# Altium project mini_DVM.PrjPcb
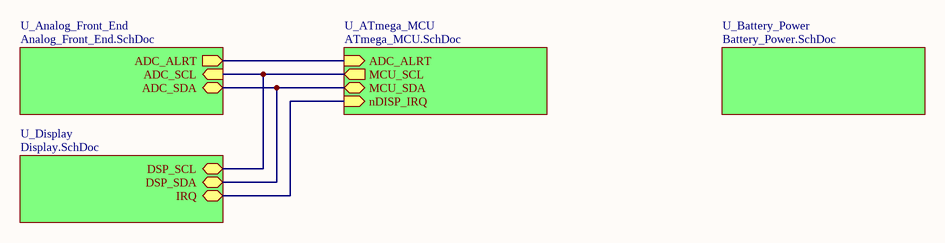
[diagram p0: DVM_TopLevel.SchDoc]
5 sheets, 62 parts. Net scope: hierarchical (ports join the sheet entries above them; power ports are global).
Board file: mini-dvm.PcbDoc
Sheets:
  DVM_TopLevel.SchDoc
    U_Analog_Front_End = Analog_Front_End.SchDoc
    U_ATmega_MCU = ATmega_MCU.SchDoc
    U_Display = Display.SchDoc
    U_Battery_Power = Battery_Power.SchDoc

## Sheet DVM_TopLevel.SchDoc
size B; Organization: Mechanart, LLC; Address1: 397 Laurie Meadows Drive; Address2: Apt. 437; Address3: San Mateo, CA 94403

### Sub-sheets
U_Analog_Front_End = Analog_Front_End.SchDoc: ADC_ALRT (out), ADC_SCL (in), ADC_SDA (bidir)
U_ATmega_MCU = ATmega_MCU.SchDoc: ADC_ALRT (in), MCU_SDA (bidir), MCU_SCL (out), nDISP_IRQ (in)
U_Battery_Power = Battery_Power.SchDoc: no entries
U_Display = Display.SchDoc: DSP_SCL, DSP_SDA, IRQ

### Nets
MCU_SCL: sheet U_Analog_Front_End/ADC_SCL, sheet U_ATmega_MCU/MCU_SCL, sheet U_Display/DSP_SCL
MCU_SDA: sheet U_Analog_Front_End/ADC_SDA, sheet U_ATmega_MCU/MCU_SDA, sheet U_Display/DSP_SDA
NetR23_1: sheet U_Analog_Front_End/ADC_ALRT, sheet U_ATmega_MCU/ADC_ALRT
NetU2_32: sheet U_ATmega_MCU/nDISP_IRQ, sheet U_Display/IRQ

### Notes on the sheet
- Title
- Size:
- Date:
- B
- Number:
- Time:
- Revision:
- Sheet
- of
- File:

## Sheet Analog_Front_End.SchDoc
size B; Organization: Mechanart, LLC; Address1: 397 Laurie Meadows Drive; Address2: Apt. 437; Address3: San Mateo, CA 94403
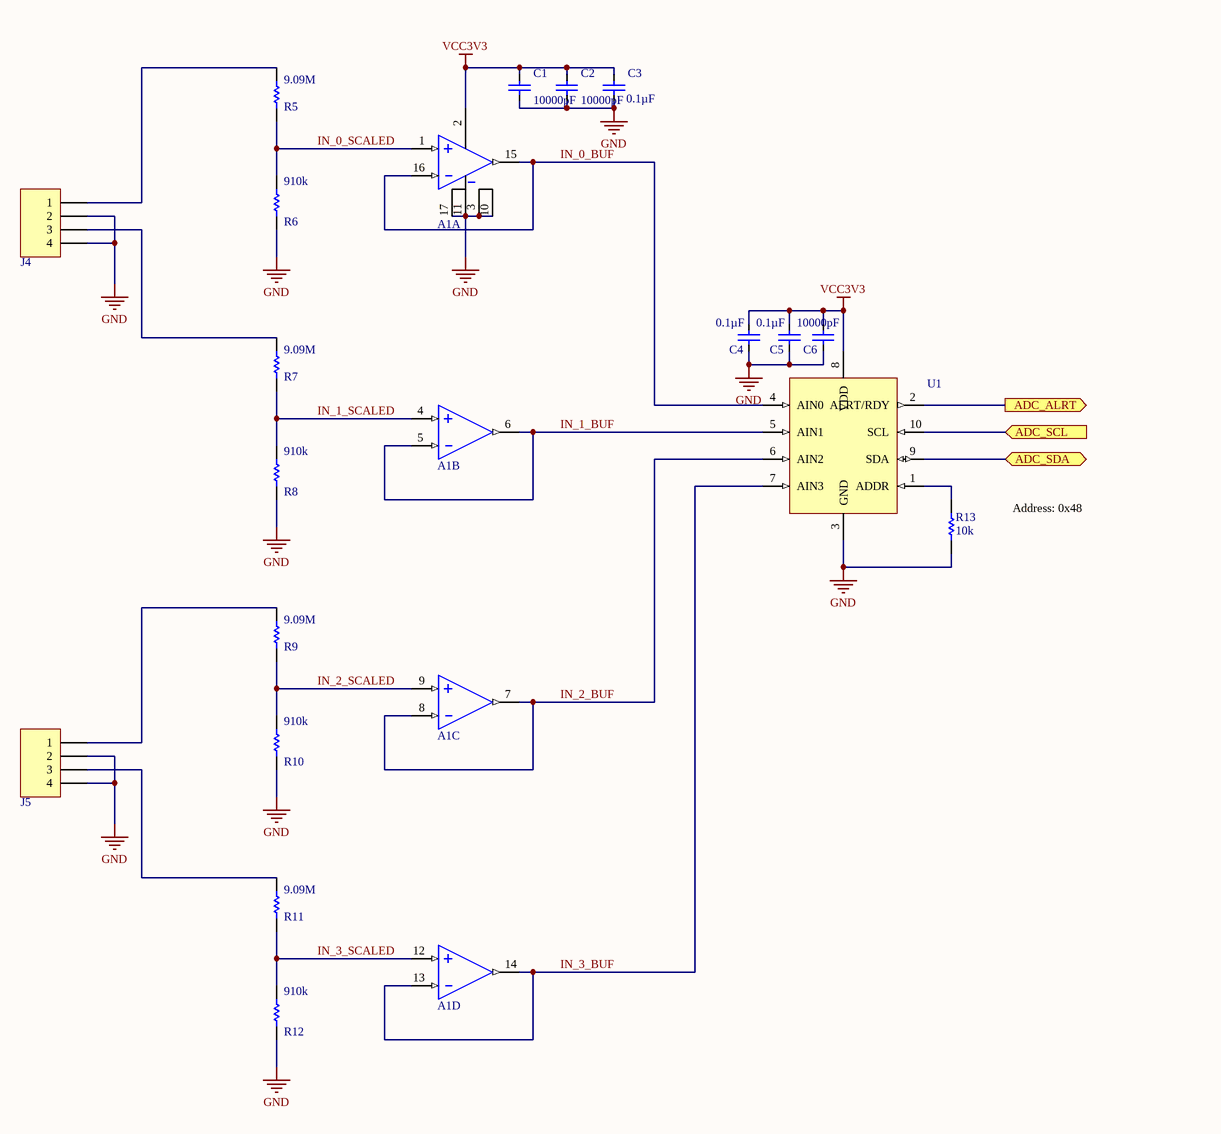
[diagram p1: Analog_Front_End.SchDoc]

### Parts
A1  TSU104  [QFN50P300X300X100-17T180X180L]  (value not drawn)  (parts A,B,C,D of 4)
C1  10000pF  [CAPC1005X50L25N]
C2  10000pF  [CAPC1005X50L25N]
C3  0.1µF  [CAPC1005X50L25N]
C4  0.1µF  [CAPC1005X50L25N]
C5  0.1µF  [CAPC1005X50L25N]
C6  10000pF  [CAPC1005X50L25N]
J4  (no value)  [HEADER_4_RA]
J5  (no value)  [HEADER_4_RA]
R5  9.09M  [RESC1508X50L30L]
R6  910k  [RESC1508X50L30L]
R7  9.09M  [RESC1508X50L30L]
R8  910k  [RESC1508X50L30L]
R9  9.09M  [RESC1508X50L30L]
R10  910k  [RESC1508X50L30L]
R11  9.09M  [RESC1508X50L30L]
R12  910k  [RESC1508X50L30L]
R13  10k  [RESC1005X40L25N]
U1  ADS1115  [X2QFN-10]  (value not drawn)

### Ports
ADC_ALRT (out), ADC_SCL (in), ADC_SDA (bidir)

### Nets
GND: A1.3(NC) A1.10(NC) A1.11(VSS) A1.17(PAD) C1.2 C2.2 C3.2 C4.2 C5.2 C6.2 J4.2 J4.4 J5.2 J5.4 R6.1 R8.1 R10.1 R12.1 R13.1 U1.3(GND)
VCC3V3: A1.2(VDD) C1.1 C2.1 C3.1 C4.1 C5.1 C6.1 U1.8(VDD)
IN_0_BUF: A1.15(OUTA) A1.16(INA_NEG) U1.4(AIN0)
IN_0_SCALED: A1.1(INA_POS) R5.1 R6.2
IN_1_BUF: A1.5(INB_NEG) A1.6(OUTB) U1.5(AIN1)
IN_1_SCALED: A1.4(INB_POS) R7.1 R8.2
IN_2_BUF: A1.7(OUTC) A1.8(INC_NEG) U1.6(AIN2)
IN_2_SCALED: A1.9(INC_POS) R9.1 R10.2
IN_3_BUF: A1.13(IND_NEG) A1.14(OUTD) U1.7(AIN3)
IN_3_SCALED: A1.12(IND_POS) R11.1 R12.2
MCU_SCL: U1.10(SCL) ; port ADC_SCL
MCU_SDA: U1.9(SDA) ; port ADC_SDA
NetJ4_1: J4.1 R5.2
NetJ4_3: J4.3 R7.2
NetJ5_1: J5.1 R9.2
NetJ5_3: J5.3 R11.2
NetR13_2: R13.2 U1.1(ADDR)
NetR23_1: U1.2(ALRT/RDY) ; port ADC_ALRT

### Notes on the sheet
- Address: 0x48
- Title
- Size:
- Date:
- B
- Number:
- Time:
- Revision:
- Sheet
- of
- File:

### Library data of the parts
A1 = TSU104IQ4T: IC OPAMP 5V CMOS NANOPWR 16QFN; Manufacturer: STMicroelectronics; Current - Supply: 650nA; Amplifier Type: General Purpose; Number of Circuits: 4; Output Type: Rail-to-Rail; Slew Rate: 0.003 V/µs; Gain Bandwidth Product: 9kHz; Current - Input Bias: 1pA; Voltage - Input Offset: 100µV; Current - Output / Channel: 11mA; Voltage - Supply, Single/Dual (±): 1.5 V ~ 5.5 V; Design Item Id: TSU104IQ4T; Supplier 1: Digi-Key; Supplier Part Number 1: 497-14091-1-ND; Manufacturer Part Number: TSU104IQ4T; RoHS: RoHS Compliant; Category: Integrated Circuits (ICs); Stock 1: 451; Pricing 1: 1=1.65, 10=1.485, 100=1.1914, 500=0.9792, 1000=0.81056 (USD); Packaging: Cut Tape (CT); Operating Temperature: -40°C ~ 85°C; Mounting Type: Surface Mount; Package / Case: 16-VFQFN Exposed Pad; Supplier Device Package: 16-QFN (3x3); ComponentLink1URL: http://www.st.com/st-web-ui/static/active/en/resource/technical/document/datasheet/DM00078536.pdf; ComponentLink1Description: http://www.st.com/st-web-ui/static/active/en/resource/technical/document/datasheet/DM00078536.pdf; -3db Bandwidth: -
C1 C2 C6 = GRM155R71H103KA88D: CAP CER 10000PF 50V X7R 0402; Manufacturer: Murata Electronics North America; Tolerance: ±10%; Design Item Id: GRM155R71H103KA88D; Supplier 1: Digi-Key; Supplier Part Number 1: 490-4516-1-ND; Manufacturer Part Number: GRM155R71H103KA88D; RoHS: RoHS Compliant; Category: Capacitors; Stock 1: 2228905; Pricing 1: 1=0.1, 10=0.012, 50=0.0066, 100=0.0055, 250=0.00452, 500=0.00386, 1000=0.003, 5000=0.0025 (USD); Packaging: Cut Tape (CT); Applications: General Purpose; Operating Temperature: -55°C ~ 125°C; Mounting Type: Surface Mount, MLCC; Package / Case: 0402 (1005 Metric); ComponentLink1URL: http://www.murata.com/~/media/webrenewal/support/library/catalog/products/capacitor/mlcc/c02e.ashx; ComponentLink1Description: http://www.murata.com/~/media/webrenewal/support/library/catalog/products/capacitor/mlcc/c02e.ashx; Capacitance: 10000pF; Voltage - Rated: 50V; Temperature Coefficient: X7R; Ratings: -; Size / Dimension: 0.039" L x 0.020" W (1.00mm x 0.50mm); Height - Seated (Max): -; Thickness (Max): 0.022" (0.55mm); Lead Spacing: -; Features: -; Lead Style: -
C3-C5 = GRM155R71H104KE14D: CAP CER 0.1UF 50V X7R 0402; Manufacturer: Murata Electronics North America; Tolerance: ±10%; Design Item Id: GRM155R71H104KE14D; Supplier 1: Digi-Key; Supplier Part Number 1: 490-10700-1-ND; Manufacturer Part Number: GRM155R71H104KE14D; RoHS: RoHS Compliant; Category: Capacitors; Stock 1: 28600; Pricing 1: 1=0.1, 10=0.029, 50=0.0156, 100=0.0132, 250=0.0108, 500=0.00924, 1000=0.0072, 5000=0.006 (USD); Packaging: Cut Tape (CT); Applications: General Purpose; Operating Temperature: -55°C ~ 125°C; Mounting Type: Surface Mount, MLCC; Package / Case: 0402 (1005 Metric); ComponentLink1URL: http://www.murata.com/~/media/webrenewal/support/library/catalog/products/capacitor/mlcc/c02e.ashx; ComponentLink1Description: http://www.murata.com/~/media/webrenewal/support/library/catalog/products/capacitor/mlcc/c02e.ashx; Capacitance: 0.1µF; Voltage - Rated: 50V; Temperature Coefficient: X7R; Ratings: -; Size / Dimension: 0.039" L x 0.020" W (1.00mm x 0.50mm); Height - Seated (Max): -; Thickness (Max): 0.022" (0.55mm); Lead Spacing: -; Features: -; Lead Style: -
J4 J5 = 5-104186-1: CONN HEADER 4POS R/A GOLD T/H; Manufacturer: TE Connectivity AMP Connectors; Connector Type: Header, Unshrouded; Number of Positions: 4; Number of Positions Loaded: All; Pitch: 0.050" (1.27mm); Design Item Id: 5-104186-1; Supplier 1: Digi-Key; Supplier Part Number 1: A115235-ND; Manufacturer Part Number: 5-104186-1; RoHS: RoHS Compliant; Category: Connectors, Interconnects; Stock 1: 114; Pricing 1: 1=2.67, 25=2.43, 50=2.34, 100=1.96, 500=1.89, 1000=1.61, 2500=1.29, 5000=1.23 (USD); Packaging: Tube; Mounting Type: Through Hole, Right Angle; ComponentLink1URL: http://www.te.com/commerce/DocumentDelivery/DDEController?Action=srchrtrv&DocNm=104186&DocType=Customer+Drawing&DocLang=English; ComponentLink1Description: http://www.te.com/commerce/DocumentDelivery/DDEController?Action=srchrtrv&DocNm=104186&DocType=Customer+Drawing&DocLang=English; Contact Type: Male Pin; Number of Rows: 1; Row Spacing: -; Contact Mating Length: 0.125" (3.18mm); Termination: Solder; Fastening Type: -; Features: -; Contact Finish: Gold; Contact Finish Thickness: 30µin (0.76µm); Color: Black
R5 R7 R9 R11 = CRCW06039M09FKEA: RES SMD 9.09M OHM 1% 1/10W 0603; Manufacturer: Vishay Dale; Power (Watts): 0.1W, 1/10W; Temperature Coefficient: ±100ppm/°C; Design Item Id: CRCW06039M09FKEA; Resistance: 9.09M; Footprint: RESC_1608[0603]_N; Supplier 1: Digi-Key; Supplier Part Number 1: 541-9.09MHCT-ND; Manufacturer Part Number: CRCW06039M09FKEA; RoHS: RoHS Compliant; Category: Resistors; Stock 1: 67332; Pricing 1: 10=0.081, 50=0.0436, 200=0.0251, 1000=0.01711 (USD); Packaging: Cut Tape (CT); Operating Temperature: -55°C ~ 155°C; Package / Case: 0603 (1608 Metric); Supplier Device Package: 0603 (1608 Metric); ComponentLink1URL: http://www.vishay.com/docs/20035/dcrcwe3.pdf; ComponentLink1Description: http://www.vishay.com/docs/20035/dcrcwe3.pdf; Tolerance: ±1%; Composition: Thick Film; Features: Automotive AEC-Q200; Size / Dimension: 0.061" L x 0.033" W (1.55mm x 0.85mm); Height: 0.020" (0.50mm); Number of Terminations: 2
R6 R8 R10 R12 = CRCW0603910KFKEA: RES SMD 910K OHM 1% 1/10W 0603; Manufacturer: Vishay Dale; Power (Watts): 0.1W, 1/10W; Temperature Coefficient: ±100ppm/°C; Design Item Id: CRCW0603910KFKEA; Resistance: 910k; Footprint: RESC_1608[0603]_N; Supplier 1: Digi-Key; Supplier Part Number 1: 541-910KHCT-ND; Manufacturer Part Number: CRCW0603910KFKEA; RoHS: RoHS Compliant; Category: Resistors; Stock 1: 12023; Pricing 1: 10=0.081, 50=0.0436, 200=0.0251, 1000=0.01711 (USD); Packaging: Cut Tape (CT); Operating Temperature: -55°C ~ 155°C; Package / Case: 0603 (1608 Metric); Supplier Device Package: 0603 (1608 Metric); ComponentLink1URL: http://www.vishay.com/docs/20035/dcrcwe3.pdf; ComponentLink1Description: http://www.vishay.com/docs/20035/dcrcwe3.pdf; Tolerance: ±1%; Composition: Thick Film; Features: Automotive AEC-Q200; Size / Dimension: 0.061" L x 0.033" W (1.55mm x 0.85mm); Height: 0.020" (0.50mm); Number of Terminations: 2
R13 = CRCW040210K0JNED: RES SMD 10K OHM 5% 1/16W 0402; Manufacturer: Vishay Dale; Power (Watts): 0.063W, 1/16W; Temperature Coefficient: ±200ppm/°C; Design Item Id: CRCW040210K0JNED; Resistance: 10k; Footprint: RESC_1005[0402]_N; Supplier 1: Digi-Key; Supplier Part Number 1: 541-10KJCT-ND; Manufacturer Part Number: CRCW040210K0JNED; RoHS: RoHS Compliant; Category: Resistors; Stock 1: 446077; Pricing 1: 10=0.074, 50=0.04, 200=0.02295, 1000=0.01566 (USD); Packaging: Cut Tape (CT); Operating Temperature: -55°C ~ 155°C; Package / Case: 0402 (1005 Metric); Supplier Device Package: 0402 (1005 Metric); ComponentLink1URL: http://www.vishay.com/docs/20035/dcrcwe3.pdf; ComponentLink1Description: http://www.vishay.com/docs/20035/dcrcwe3.pdf; Tolerance: ±5%; Composition: Thick Film; Features: Automotive AEC-Q200; Size / Dimension: 0.039" L x 0.020" W (1.00mm x 0.50mm); Height: 0.016" (0.40mm); Number of Terminations: 2
U1 = ADS1115IRUGT: IC ADC 16-BIT I2C PROGBL 10-QFN; Manufacturer: Texas Instruments; INDUSTRY_STD_PKG_TYPE: X2QFN; FAMILY_NAME: PRECISION ADC (<=10MSPS); PIN_COUNT: 10; PACKAGE_DESIGNATOR: RUG; Number of Bits: 16; Sampling Rate (Per Second): 860; Number of Inputs: 2, 4; Input Type: Differential, Single Ended; Data Interface: I²C; Configuration: MUX-PGA-ADC; Number of A/D Converters: 1; Architecture: Sigma-Delta; Reference Type: Internal; Voltage - Supply, Analog: 2 V ~ 5.5 V; Datasheet URL: http://www.ti.com/lit/gpn/ADS1115; GENERIC_PART_NUMBER: ADS1115; RefDes: RefDes; Type: DEV; Value: Value; Design Item Id: ADS1115IRUGT; Supplier 1: Digi-Key; Supplier Part Number 1: 296-24935-1-ND; Manufacturer Part Number: ADS1115IRUGT; RoHS: RoHS Compliant; Category: Integrated Circuits (ICs); Stock 1: 2756; Pricing 1: 1=6.68, 10=5.96, 25=5.36, 50=5.12, 100=4.88 (USD); Packaging: Cut Tape (CT); Operating Temperature: -40°C ~ 125°C; Package / Case: 10-XFQFN; Supplier Device Package: 10-X2QFN (2x1.5); ComponentLink1URL: http://www.ti.com/lit/ds/symlink/ads1113.pdf; ComponentLink1Description: http://www.ti.com/lit/ds/symlink/ads1113.pdf; Voltage - Supply, Digital: 2 V ~ 5.5 V; Features: PGA, Selectable Address

## Sheet ATmega_MCU.SchDoc
size B; Organization: Mechanart, LLC; Address1: 397 Laurie Meadows Drive; Address2: Apt. 437; Address3: San Mateo, CA 94403
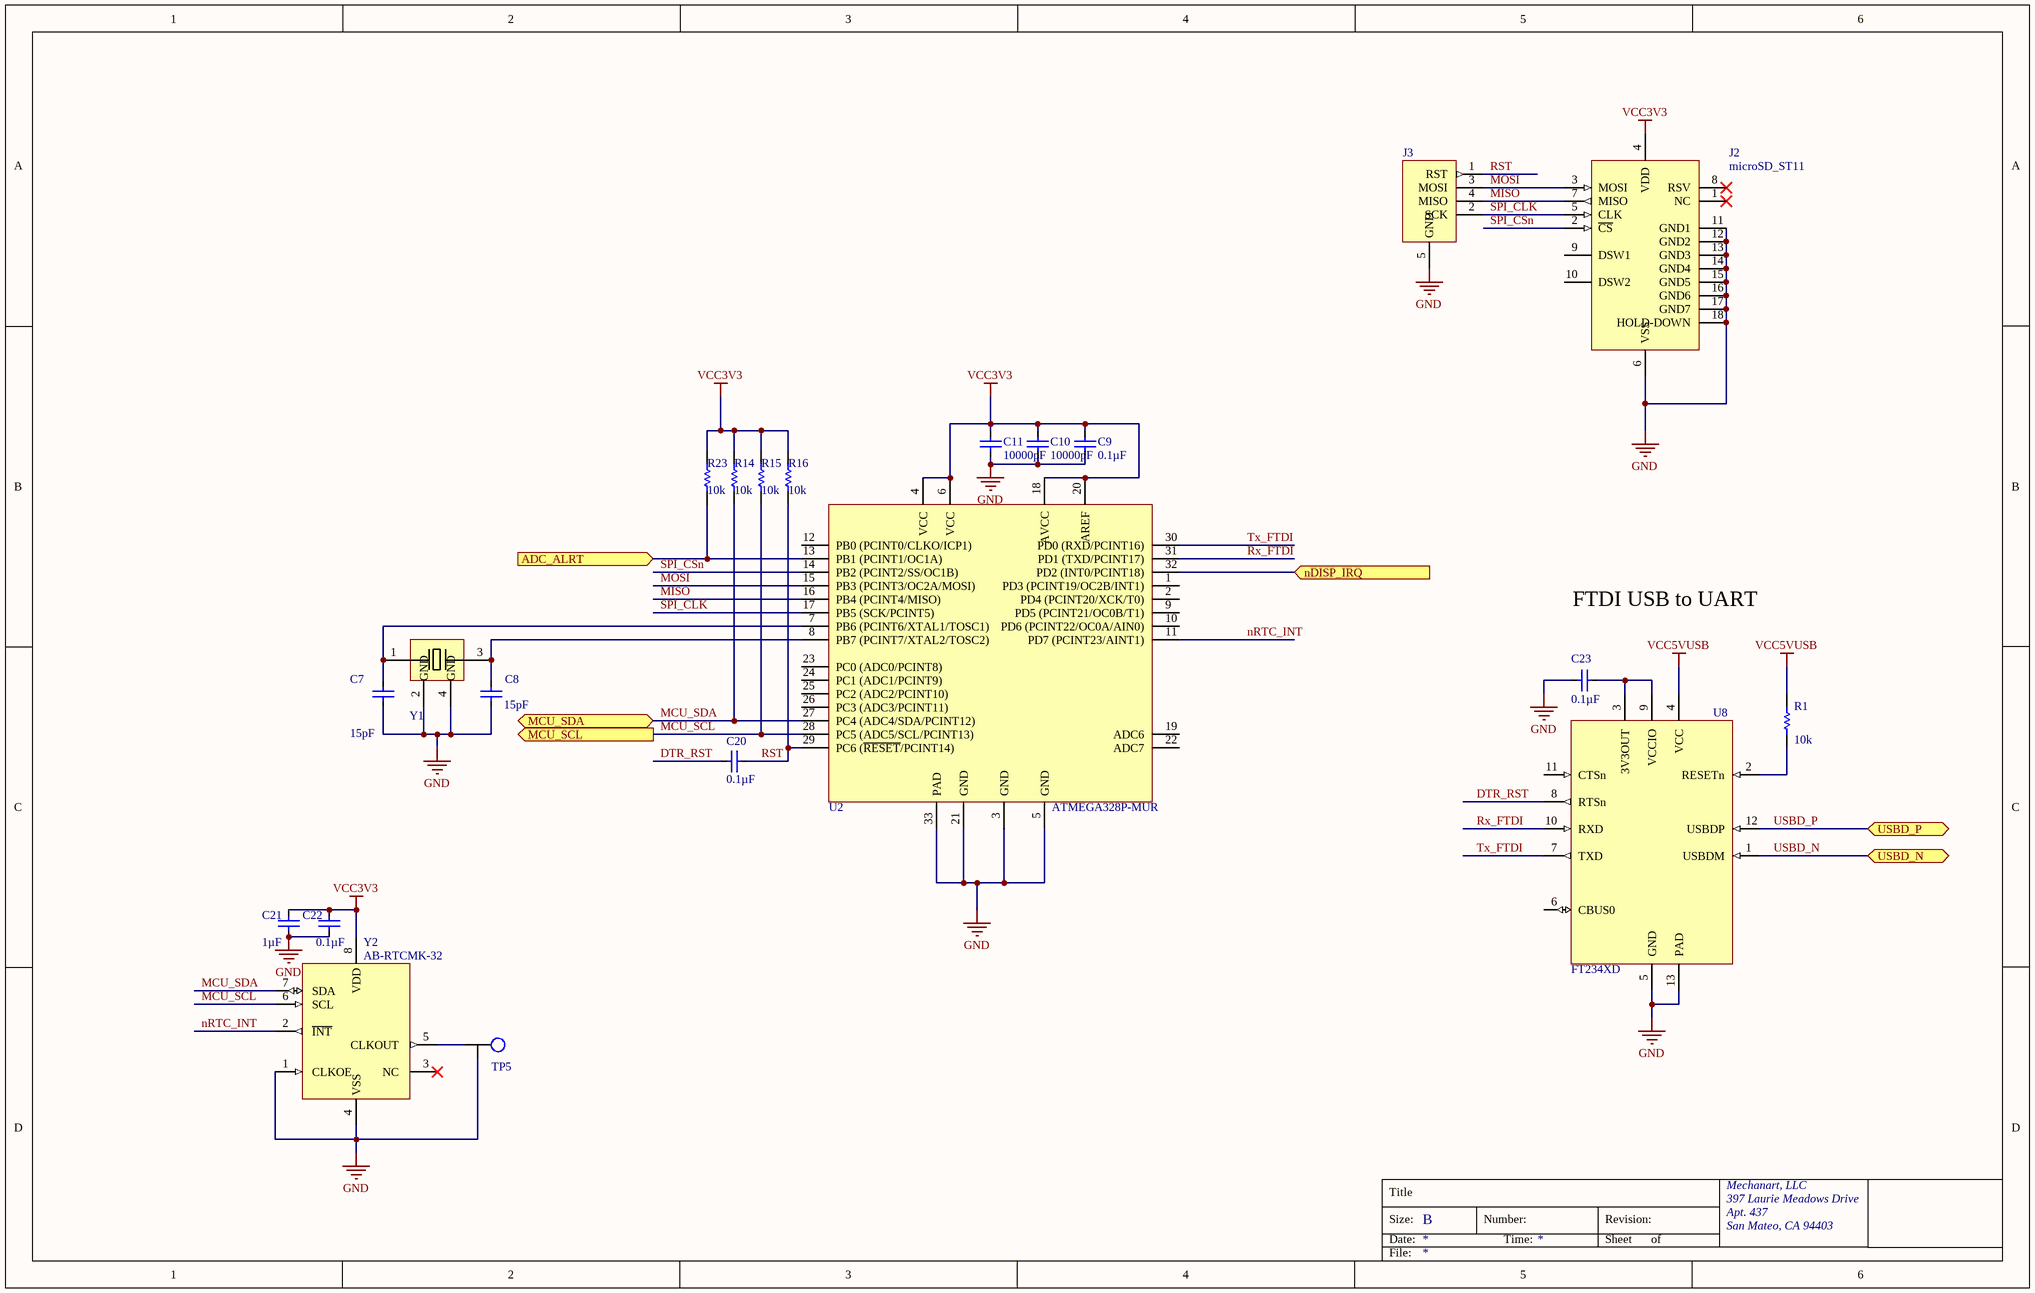
[diagram p2: ATmega_MCU.SchDoc]

### Parts
C7  15pF  [CAPC0603X33L15L]
C8  15pF  [CAPC0603X33L15L]
C9  0.1µF  [CAPC1005X50L25N]
C10  10000pF  [CAPC1005X50L25N]
C11  10000pF  [CAPC1005X50L25N]
C20  0.1µF  [CAPC1005X50L25N]
C21  1µF  [CAPC1005X50L25N]
C22  0.1µF  [CAPC1005X50L25N]
C23  0.1µF  [CAPC1005X50L25N]
J2  microSD_ST11  [microSD_ST11-H]
J3  POGO_SPI  [POGO_SPI]  (value not drawn)
R1  10k  [RESC1608X45L30N]
R14  10k  [RESC1005X40L25N]
R15  10k  [RESC1005X40L25N]
R16  10k  [RESC1005X40L25N]
R23  10k  [RESC1005X40L25N]
TP5  TPwGND  [TPwGND]  (value not drawn)
U2  Manufacturer Part Number: ATMEGA328P-MUR  [QFN50P500X500X100-33T325X325L]  (hidden comment: ATMEGA328P_32MLF)
U8  FT234XD  [SON13P45_300X300X80L40X23T250X160N]
Y1  ABM11  [XTALDFN200X160X59-4L]  (value not drawn)
Y2  AB-RTCMK-32  [SON100P320X250X100-8L]

### Ports
ADC_ALRT (in), MCU_SCL (out), MCU_SDA (bidir), nDISP_IRQ (in), USBD_N (bidir), USBD_P (bidir)

### Nets
GND: C7.2 C8.2 C9.2 C10.2 C11.2 C21.2 C22.2 C23.1 J2.6(VSS) J2.11(GND1) J2.12(GND2) J2.13(GND3) J2.14(GND4) J2.15(GND5) J2.16(GND6) J2.17(GND7) J2.18(HOLD-DOWN) J3.5(GND) TP5.2(GND) U2.3(GND) U2.5(GND) U2.21(GND) U2.33(PAD) U8.5(GND) U8.13(PAD) Y1.2(GND) Y1.4(GND) Y2.1(CLKOE) Y2.4(VSS)
VCC3V3: C9.1 C10.1 C11.1 C21.1 C22.1 J2.4(VDD) R14.2 R15.2 R16.2 R23.2 U2.4(VCC) U2.6(VCC) U2.18(AVCC) U2.20(AREF) Y2.8(VDD)
VCC5VUSB: R1.2 U8.4(VCC)
DTR_RST: C20.1 U8.8(RTSn)
MCU_SCL: R15.1 U2.28(PC5_(ADC5/SCL/PCINT13)) Y2.6(SCL) ; port MCU_SCL
MCU_SDA: R14.1 U2.27(PC4_(ADC4/SDA/PCINT12)) Y2.7(SDA) ; port MCU_SDA
MISO: J2.7(MISO) J3.4(MISO) U2.16(PB4_(PCINT4/MISO))
MOSI: J2.3(MOSI) J3.3(MOSI) U2.15(PB3_(PCINT3/OC2A/MOSI))
nRTC_INT: U2.11(PD7_(PCINT23/AINT1)) Y2.2(~{INT})
RST: C20.2 J3.1(RST) R16.1 U2.29(PC6_(~{RESET}/PCINT14))
Rx_FTDI: U2.31(PD1_(TXD/PCINT17)) U8.10(RXD)
SPI_CLK: J2.5(CLK) J3.2(SCK) U2.17(PB5_(SCK/PCINT5))
SPI_CSn: J2.2(~{CS}) U2.14(PB2_(PCINT2/SS/OC1B))
Tx_FTDI: U2.30(PD0_(RXD/PCINT16)) U8.7(TXD)
USBD_N: U8.1(USBDM) ; port USBD_N
USBD_P: U8.12(USBDP) ; port USBD_P
NetC7_1: C7.1 U2.7(PB6_(PCINT6/XTAL1/TOSC1)) Y1.1(OSC1)
NetC8_1: C8.1 U2.8(PB7_(PCINT7/XTAL2/TOSC2)) Y1.3(OSC2)
NetC23_2: C23.2 U8.3(3V3OUT) U8.9(VCCIO)
NetR1_1: R1.1 U8.2(RESETn)
NetR23_1: R23.1 U2.13(PB1_(PCINT1/OC1A)) ; port ADC_ALRT
NetTP5_1: TP5.1(TP) Y2.5(CLKOUT)
NetU2_32: U2.32(PD2_(INT0/PCINT18)) ; port nDISP_IRQ

Not connected (* = marked no-connect by the designer): J2 1(NC)* 8(RSV)* 9(DSW1) 10(DSW2); U2 1(PD3_(PCINT19/OC2B/INT1)) 2(PD4_(PCINT20/XCK/T0)) 9(PD5_(PCINT21/OC0B/T1)) 10(PD6_(PCINT22/OC0A/AIN0)) 12(PB0_(PCINT0/CLKO/ICP1)) 19(ADC6) 22(ADC7) 23(PC0_(ADC0/PCINT8)) 24(PC1_(ADC1/PCINT9)) 25(PC2_(ADC2/PCINT10)) 26(PC3_(ADC3/PCINT11)); U8 6(CBUS0) 11(CTSn); Y2 3(NC)*

### Notes on the sheet
- FTDI USB to UART
- Title
- Size:
- Date:
- B
- Number:
- Time:
- Revision:
- Sheet
- of
- File:

### Library data of the parts
C7 C8 = GJM0335C1E150GB01D: CAP CER 15PF 25V NP0 0201; Manufacturer: Murata Electronics North America; Tolerance: ±2%; Temperature Coefficient: C0G, NP0; Design Item Id: GJM0335C1E150GB01D; Supplier 1: Digi-Key; Supplier Part Number 1: 490-10562-1-ND; Manufacturer Part Number: GJM0335C1E150GB01D; RoHS: RoHS Compliant; Category: Capacitors; Stock 1: 25849; Pricing 1: 1=0.19, 10=0.128, 50=0.0736, 100=0.0608, 250=0.0512, 500=0.04288, 1000=0.0352, 5000=0.02976 (USD); Packaging: Cut Tape (CT); Applications: RF, Microwave, High Frequency; Operating Temperature: -55°C ~ 125°C; Mounting Type: Surface Mount, MLCC; Package / Case: 0201 (0603 Metric); ComponentLink1URL: http://www.murata.com/~/media/webrenewal/support/library/catalog/products/capacitor/mlcc/c02e.ashx; ComponentLink1Description: http://www.murata.com/~/media/webrenewal/support/library/catalog/products/capacitor/mlcc/c02e.ashx; Capacitance: 15pF; Voltage - Rated: 25V; Ratings: -; Size / Dimension: 0.024" L x 0.012" W (0.60mm x 0.30mm); Height - Seated (Max): -; Thickness (Max): 0.013" (0.33mm); Lead Spacing: -; Features: High Q, Low Loss; Lead Style: -
C9 C20 C22 C23 = GRM155R71H104KE14D: as C3 on sheet Analog_Front_End; Design Item Id: GRM155R71H104KE14D; Supplier 1: Digi-Key; Supplier Part Number 1: 490-10700-1-ND; Manufacturer Part Number: GRM155R71H104KE14D; RoHS: RoHS Compliant; Category: Capacitors; Stock 1: 28600; Pricing 1: 1=0.1, 10=0.029, 50=0.0156, 100=0.0132, 250=0.0108, 500=0.00924, 1000=0.0072, 5000=0.006 (USD); Packaging: Cut Tape (CT); Applications: General Purpose; Operating Temperature: -55°C ~ 125°C; Mounting Type: Surface Mount, MLCC; Package / Case: 0402 (1005 Metric); ComponentLink1URL: http://www.murata.com/~/media/webrenewal/support/library/catalog/products/capacitor/mlcc/c02e.ashx; ComponentLink1Description: http://www.murata.com/~/media/webrenewal/support/library/catalog/products/capacitor/mlcc/c02e.ashx; Capacitance: 0.1µF; Voltage - Rated: 50V; Temperature Coefficient: X7R; Ratings: -; Size / Dimension: 0.039" L x 0.020" W (1.00mm x 0.50mm); Height - Seated (Max): -; Thickness (Max): 0.022" (0.55mm); Lead Spacing: -; Features: -; Lead Style: -
C10 C11 = GRM155R71H103KA88D: as C1 on sheet Analog_Front_End; Design Item Id: GRM155R71H103KA88D; Supplier 1: Digi-Key; Supplier Part Number 1: 490-4516-1-ND; Manufacturer Part Number: GRM155R71H103KA88D; RoHS: RoHS Compliant; Category: Capacitors; Stock 1: 2228905; Pricing 1: 1=0.1, 10=0.012, 50=0.0066, 100=0.0055, 250=0.00452, 500=0.00386, 1000=0.003, 5000=0.0025 (USD); Packaging: Cut Tape (CT); Applications: General Purpose; Operating Temperature: -55°C ~ 125°C; Mounting Type: Surface Mount, MLCC; Package / Case: 0402 (1005 Metric); ComponentLink1URL: http://www.murata.com/~/media/webrenewal/support/library/catalog/products/capacitor/mlcc/c02e.ashx; ComponentLink1Description: http://www.murata.com/~/media/webrenewal/support/library/catalog/products/capacitor/mlcc/c02e.ashx; Capacitance: 10000pF; Voltage - Rated: 50V; Temperature Coefficient: X7R; Ratings: -; Size / Dimension: 0.039" L x 0.020" W (1.00mm x 0.50mm); Height - Seated (Max): -; Thickness (Max): 0.022" (0.55mm); Lead Spacing: -; Features: -; Lead Style: -
C21 = GRM155R70J105KA12D: CAP CER 1UF 6.3V X7R 0402; Manufacturer: Murata Electronics North America; Tolerance: ±10%; Design Item Id: GRM155R70J105KA12D; Supplier 1: Digi-Key; Supplier Part Number 1: 490-10024-1-ND; Manufacturer Part Number: GRM155R70J105KA12D; RoHS: RoHS Compliant; Category: Capacitors; Stock 1: 26230; Pricing 1: 1=0.1, 10=0.076, 50=0.041, 100=0.0347, 250=0.02836, 500=0.02426, 1000=0.0189, 5000=0.01575 (USD); Packaging: Cut Tape (CT); Applications: General Purpose; Operating Temperature: -55°C ~ 125°C; Mounting Type: Surface Mount, MLCC; Package / Case: 0402 (1005 Metric); ComponentLink1URL: http://www.murata.com/~/media/webrenewal/support/library/catalog/products/capacitor/mlcc/c02e.ashx; ComponentLink1Description: http://www.murata.com/~/media/webrenewal/support/library/catalog/products/capacitor/mlcc/c02e.ashx; Capacitance: 1µF; Voltage - Rated: 6.3V; Temperature Coefficient: X7R; Ratings: -; Size / Dimension: 0.039" L x 0.020" W (1.00mm x 0.50mm); Height - Seated (Max): -; Thickness (Max): 0.022" (0.55mm); Lead Spacing: -; Features: Derating Recommended; Lead Style: -
J2 = ST11S008V4HR2000: CONN MICRO SD CARD PUSH-PUSH R/A; Manufacturer: JAE Electronics; Design Item Id: ST11S008V4HR2000; Supplier 1: Digi-Key; Supplier Part Number 1: 670-2695-1-ND; Manufacturer Part Number: ST11S008V4HR2000; RoHS: RoHS Compliant; Category: Connectors, Interconnects; Stock 1: 1343; Pricing 1: 1=2.66, 10=2.415, 25=2.2668, 50=2.1684, 100=2.0698, 250=1.87264, 500=1.7248, 1000=1.4784 (USD); Packaging: Cut Tape (CT)
J3 = POGO_SPI: 5-pin SPI ISP pogo land with RST + GND; Design Item Id: POGO_SPI
R1 = ERJ-3GEYJ103V: RES 10K OHM 1/10W 5% 0603 SMD; Manufacturer: Panasonic Electronic Components; Power (Watts): 0.1W, 1/10W; Temperature Coefficient: ±200ppm/°C; Resistance: 10k; Design Item Id: ERJ-3GEYJ103V; Footprint: RESC_1608[0603]_N; Supplier 1: Digi-Key; Supplier Part Number 1: P10KGCT-ND; Manufacturer Part Number: ERJ-3GEYJ103V; RoHS: RoHS Compliant; Category: Resistors; Stock 1: 3519552; Pricing 1: 1=0.1, 50=0.0126, 100=0.0096, 250=0.00716, 500=0.00528, 1000=0.00352, 2500=0.00297 (USD); Packaging: Cut Tape (CT); Operating Temperature: -55°C ~ 155°C; Package / Case: 0603 (1608 Metric); Supplier Device Package: 0603; ComponentLink1URL: http://industrial.panasonic.com/www-cgi/jvcr13pz.cgi?E+PZ+3+AOA0001+ERJ3GEYJ103V+7+WW; ComponentLink1Description: http://industrial.panasonic.com/www-cgi/jvcr13pz.cgi?E+PZ+3+AOA0001+ERJ3GEYJ103V+7+WW; Tolerance: ±5%; Composition: Thick Film; Features: Automotive AEC-Q200 Qualified; Size / Dimension: 0.063" L x 0.031" W (1.60mm x 0.80mm); Height: 0.022" (0.55mm); Number of Terminations: 2
R14-R16 R23 = CRCW040210K0JNED: as R13 on sheet Analog_Front_End; Design Item Id: CRCW040210K0JNED; Resistance: 10k; Footprint: RESC_1005[0402]_N; Supplier 1: Digi-Key; Supplier Part Number 1: 541-10KJCT-ND; Manufacturer Part Number: CRCW040210K0JNED; RoHS: RoHS Compliant; Category: Resistors; Stock 1: 446077; Pricing 1: 10=0.074, 50=0.04, 200=0.02295, 1000=0.01566 (USD); Packaging: Cut Tape (CT); Operating Temperature: -55°C ~ 155°C; Package / Case: 0402 (1005 Metric); Supplier Device Package: 0402 (1005 Metric); ComponentLink1URL: http://www.vishay.com/docs/20035/dcrcwe3.pdf; ComponentLink1Description: http://www.vishay.com/docs/20035/dcrcwe3.pdf; Tolerance: ±5%; Composition: Thick Film; Features: Automotive AEC-Q200; Size / Dimension: 0.039" L x 0.020" W (1.00mm x 0.50mm); Height: 0.016" (0.40mm); Number of Terminations: 2
U2 = ATMEGA328P-MUR: IC MCU 8BIT 32KB FLASH 32QFN; Manufacturer: Atmel; Core Processor: AVR; Core Size: 8-Bit; Speed: 20MHz; Connectivity: I²C, SPI, UART/USART; Peripherals: Brown-out Detect/Reset, POR, PWM, WDT; Number of I/O: 23; Program Memory Size: 32KB (16K x 16); EEPROM Size: 1K x 8; RAM Size: 2K x 8; Voltage - Supply (Vcc/Vdd): 1.8 V ~ 5.5 V; Data Converters: A/D 8x10b; Oscillator Type: Internal; Design Item Id: ATMEGA328P-MUR; Supplier 1: Digi-Key; Supplier Part Number 1: ATMEGA328P-MURCT-ND; RoHS: RoHS Compliant; Category: Integrated Circuits (ICs); Stock 1: 17278; Pricing 1: 1=3.7, 10=3.305, 25=2.9748, 100=2.7103, 250=2.44588, 500=2.19468, 1000=1.85094 (USD); Packaging: Cut Tape (CT); Operating Temperature: -40°C ~ 85°C; Package / Case: 32-VFQFN Exposed Pad; Supplier Device Package: 32-VQFN (5x5); ComponentLink1URL: http://www.atmel.com/images/atmel-8271-8-bit-avr-microcontroller-atmega48a-48pa-88a-88pa-168a-168pa-328-328p_datasheet_summary.pdf; ComponentLink1Description: http://www.atmel.com/images/atmel-8271-8-bit-avr-microcontroller-atmega48a-48pa-88a-88pa-168a-168pa-328-328p_datasheet_summary.pdf; Program Memory Type: FLASH
U8 = FT234XD-R: IC USB SERIAL BASIC UART 12DFN; Manufacturer: FTDI, Future Technology Devices International Ltd; Voltage - Supply: 2.97 V ~ 5.5 V; Function: Bridge, USB to UART; Standards: USB 2.0; Current - Supply: 8mA; Design Item Id: FT234XD-R; Supplier 1: Digi-Key; Supplier Part Number 1: 768-1178-1-ND; Manufacturer Part Number: FT234XD-R; RoHS: RoHS Compliant; Category: Integrated Circuits (ICs); Stock 1: 20803; Pricing 1: 1=2.3, 25=1.97, 100=1.9, 250=1.71, 500=1.5525, 1000=1.5295 (USD); Packaging: Cut Tape (CT); Operating Temperature: -40°C ~ 85°C; Package / Case: 12-VFDFN Exposed Pad; Supplier Device Package: 12-DFN (3x3); ComponentLink1URL: http://www.ftdichip.com/Support/Documents/DataSheets/ICs/DS_FT234XD.pdf; ComponentLink1Description: http://www.ftdichip.com/Support/Documents/DataSheets/ICs/DS_FT234XD.pdf; Protocol: USB; Part Status: Active; Interface: UART
Y1 = ABM11-16.000MHZ-B7G-T: CRYSTAL 16.0000MHZ 10PF SMD; Manufacturer: Abracon LLC; Frequency: 16MHz; Frequency Stability: ±15ppm; ESR (Equivalent Series Resistance): 150 Ohm; Operating Mode: Fundamental; Ratings: COTS; Design Item Id: ABM11-16.000MHZ-B7G-T; Supplier 1: Digi-Key; Supplier Part Number 1: 535-12628-1-ND; Manufacturer Part Number: ABM11-16.000MHZ-B7G-T; RoHS: RoHS Compliant; Category: Crystals and Oscillators; Stock 1: 2675; Pricing 1: 1=1.09, 10=0.968, 50=0.904, 100=0.8, 500=0.756 (USD); Packaging: Cut Tape (CT); Type: MHz Crystal; Operating Temperature: -20°C ~ 70°C; Mounting Type: Surface Mount; Package / Case: 4-SMD, No Lead (DFN, LCC); ComponentLink1URL: http://www.abracon.com/Resonators/ABM11.pdf; ComponentLink1Description: http://www.abracon.com/Resonators/ABM11.pdf; Frequency Tolerance: ±15ppm; Load Capacitance: 10pF; Size / Dimension: 0.079" L x 0.063" W (2.00mm x 1.60mm); Height: 0.023" (0.59mm)
Y2 = AB-RTCMK-32.768KHZ-T3: IC RTC CLK/CALENDAR I2C 8-SMT; Manufacturer: Abracon LLC; Voltage - Supply: 1.3 V ~ 5.5 V; Time Format: HH:MM:SS (12/24 hr); Date Format: YY-MM-DD; Interface: I²C, 2-Wire Serial; Current - Timekeeping (Max): 2µA @ 3V; Design Item Id: AB-RTCMK-32.768KHZ-T3; Supplier 1: Digi-Key; Supplier Part Number 1: 535-11916-1-ND; Manufacturer Part Number: AB-RTCMK-32.768KHZ-T3; RoHS: RoHS Compliant; Category: Integrated Circuits (ICs); Stock 1: 797; Pricing 1: 1=5.33, 10=4.773, 25=4.292, 100=3.9035, 250=3.53352, 500=3.1635, 750=2.86751, 1000=2.664 (USD); Packaging: Cut Tape (CT); Type: Clock/Calendar; Operating Temperature: -40°C ~ 85°C; Mounting Type: Surface Mount; Package / Case: 8-SMD Module; Supplier Device Package: 8-SMT; ComponentLink1URL: http://www.abracon.com/Precisiontiming/AB-RTCMK-32768kHz.pdf; ComponentLink1Description: http://www.abracon.com/Precisiontiming/AB-RTCMK-32768kHz.pdf; Features: Alarm, Leap Year, Square Wave Output, TCXO/Crystal; Memory Size: -; Voltage - Supply, Battery: -
TP5 = TPwGND: Design Item Id: TPwGND

## Sheet Display.SchDoc
size B; Organization: Mechanart, LLC; Address1: 397 Laurie Meadows Drive; Address2: Apt. 437; Address3: San Mateo, CA 94403
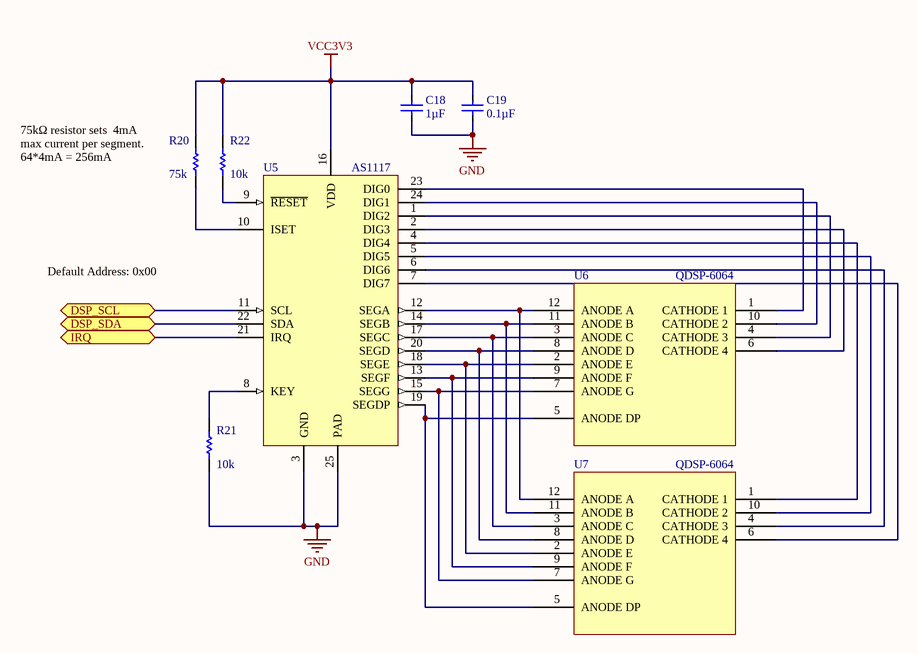
[diagram p3: Display.SchDoc]

### Parts
C18  1µF  [CAPC1005X50L25N]
C19  0.1µF  [CAPC1005X50L25N]
R20  75k  [RESC1005X40L25N]
R21  10k  [RESC1005X40L25N]
R22  10k  [RESC1005X40L25N]
U5  AS1117  [PQFN50P400X400X60-25T290X290L]
U6  QDSP-6064  [DIP762W51P254L1537H483Q12_SMT]
U7  QDSP-6064  [DIP762W51P254L1537H483Q12_SMT]

### Ports
DSP_SCL, DSP_SDA, IRQ

### Nets
GND: C18.2 C19.2 R21.1 U5.3(GND) U5.25(PAD)
VCC3V3: C18.1 C19.1 R20.2 R22.2 U5.16(VDD)
MCU_SCL: U5.11(SCL) ; port DSP_SCL
MCU_SDA: U5.22(SDA) ; port DSP_SDA
NetR20_1: R20.1 U5.10(ISET)
NetR21_2: R21.2 U5.8(KEY)
NetR22_1: R22.1 U5.9(~{RESET})
NetU2_32: U5.21(IRQ) ; port IRQ
NetU5_1: U5.1(DIG2) U6.4(CATHODE_3)
NetU5_2: U5.2(DIG3) U6.6(CATHODE_4)
NetU5_4: U5.4(DIG4) U7.1(CATHODE_1)
NetU5_5: U5.5(DIG5) U7.10(CATHODE_2)
NetU5_6: U5.6(DIG6) U7.4(CATHODE_3)
NetU5_7: U5.7(DIG7) U7.6(CATHODE_4)
NetU5_12: U5.12(SEGA) U6.12(ANODE_A) U7.12(ANODE_A)
NetU5_13: U5.13(SEGF) U6.9(ANODE_F) U7.9(ANODE_F)
NetU5_14: U5.14(SEGB) U6.11(ANODE_B) U7.11(ANODE_B)
NetU5_15: U5.15(SEGG) U6.7(ANODE_G) U7.7(ANODE_G)
NetU5_17: U5.17(SEGC) U6.3(ANODE_C) U7.3(ANODE_C)
NetU5_18: U5.18(SEGE) U6.2(ANODE_E) U7.2(ANODE_E)
NetU5_19: U5.19(SEGDP) U6.5(ANODE_DP) U7.5(ANODE_DP)
NetU5_20: U5.20(SEGD) U6.8(ANODE_D) U7.8(ANODE_D)
NetU5_23: U5.23(DIG0) U6.1(CATHODE_1)
NetU5_24: U5.24(DIG1) U6.10(CATHODE_2)

### Notes on the sheet
- (near R20) 75kΩ resistor sets  4mA max current per segment.
  64*4mA = 256mA
- Default Address: 0x00
- Title
- Size:
- Date:
- B
- Number:
- Time:
- Revision:
- Sheet
- of
- File:

### Library data of the parts
C18 = GRM155R70J105KA12D: as C21 on sheet ATmega_MCU; Design Item Id: GRM155R70J105KA12D; Supplier 1: Digi-Key; Supplier Part Number 1: 490-10024-1-ND; Manufacturer Part Number: GRM155R70J105KA12D; RoHS: RoHS Compliant; Category: Capacitors; Stock 1: 26230; Pricing 1: 1=0.1, 10=0.076, 50=0.041, 100=0.0347, 250=0.02836, 500=0.02426, 1000=0.0189, 5000=0.01575 (USD); Packaging: Cut Tape (CT); Applications: General Purpose; Operating Temperature: -55°C ~ 125°C; Mounting Type: Surface Mount, MLCC; Package / Case: 0402 (1005 Metric); ComponentLink1URL: http://www.murata.com/~/media/webrenewal/support/library/catalog/products/capacitor/mlcc/c02e.ashx; ComponentLink1Description: http://www.murata.com/~/media/webrenewal/support/library/catalog/products/capacitor/mlcc/c02e.ashx; Capacitance: 1µF; Voltage - Rated: 6.3V; Temperature Coefficient: X7R; Ratings: -; Size / Dimension: 0.039" L x 0.020" W (1.00mm x 0.50mm); Height - Seated (Max): -; Thickness (Max): 0.022" (0.55mm); Lead Spacing: -; Features: Derating Recommended; Lead Style: -
C19 = GRM155R71H104KE14D: as C3 on sheet Analog_Front_End; Design Item Id: GRM155R71H104KE14D; Supplier 1: Digi-Key; Supplier Part Number 1: 490-10700-1-ND; Manufacturer Part Number: GRM155R71H104KE14D; RoHS: RoHS Compliant; Category: Capacitors; Stock 1: 28600; Pricing 1: 1=0.1, 10=0.029, 50=0.0156, 100=0.0132, 250=0.0108, 500=0.00924, 1000=0.0072, 5000=0.006 (USD); Packaging: Cut Tape (CT); Applications: General Purpose; Operating Temperature: -55°C ~ 125°C; Mounting Type: Surface Mount, MLCC; Package / Case: 0402 (1005 Metric); ComponentLink1URL: http://www.murata.com/~/media/webrenewal/support/library/catalog/products/capacitor/mlcc/c02e.ashx; ComponentLink1Description: http://www.murata.com/~/media/webrenewal/support/library/catalog/products/capacitor/mlcc/c02e.ashx; Capacitance: 0.1µF; Voltage - Rated: 50V; Temperature Coefficient: X7R; Ratings: -; Size / Dimension: 0.039" L x 0.020" W (1.00mm x 0.50mm); Height - Seated (Max): -; Thickness (Max): 0.022" (0.55mm); Lead Spacing: -; Features: -; Lead Style: -
R20 = ERJ-2RKF7502X: RES SMD 75K OHM 1% 1/10W 0402; Manufacturer: Panasonic Electronic Components; Power (Watts): 0.1W, 1/10W; Temperature Coefficient: ±100ppm/°C; Design Item Id: ERJ-2RKF7502X; Resistance: 75k; Footprint: RESC_1005[0402]_N; Supplier 1: Digi-Key; Supplier Part Number 1: P75.0KLCT-ND; Manufacturer Part Number: ERJ-2RKF7502X; RoHS: RoHS Compliant; Category: Resistors; Stock 1: 235416; Pricing 1: 1=0.1, 50=0.015, 100=0.011, 250=0.0084, 500=0.00674, 1000=0.00496, 5000=0.00355 (USD); Packaging: Cut Tape (CT); Operating Temperature: -55°C ~ 155°C; Package / Case: 0402 (1005 Metric); Supplier Device Package: 0402; ComponentLink1URL: http://industrial.panasonic.com/www-cgi/jvcr13pz.cgi?E+PZ+3+AOA0002+ERJ2RKF7502X+7+WW; ComponentLink1Description: http://industrial.panasonic.com/www-cgi/jvcr13pz.cgi?E+PZ+3+AOA0002+ERJ2RKF7502X+7+WW; Tolerance: ±1%; Composition: Thick Film; Features: Automotive AEC-Q200; Size / Dimension: 0.039" L x 0.020" W (1.00mm x 0.50mm); Height: 0.016" (0.40mm); Number of Terminations: 2
R21 R22 = CRCW040210K0JNED: as R13 on sheet Analog_Front_End; Design Item Id: CRCW040210K0JNED; Resistance: 10k; Footprint: RESC_1005[0402]_N; Supplier 1: Digi-Key; Supplier Part Number 1: 541-10KJCT-ND; Manufacturer Part Number: CRCW040210K0JNED; RoHS: RoHS Compliant; Category: Resistors; Stock 1: 446077; Pricing 1: 10=0.074, 50=0.04, 200=0.02295, 1000=0.01566 (USD); Packaging: Cut Tape (CT); Operating Temperature: -55°C ~ 155°C; Package / Case: 0402 (1005 Metric); Supplier Device Package: 0402 (1005 Metric); ComponentLink1URL: http://www.vishay.com/docs/20035/dcrcwe3.pdf; ComponentLink1Description: http://www.vishay.com/docs/20035/dcrcwe3.pdf; Tolerance: ±5%; Composition: Thick Film; Features: Automotive AEC-Q200; Size / Dimension: 0.039" L x 0.020" W (1.00mm x 0.50mm); Height: 0.016" (0.40mm); Number of Terminations: 2
U5 = AS1117-BQFT: IC DRIVER 64LED MOBILE 24-TQFN; Manufacturer: ams; Current - Supply: 335mA; Voltage - Supply: 2.7 V ~ 5.5 V; Display Type: LED; Configuration: 8 x (7 Segment), 64 LED; Interface: I²C; Digits or Characters: 8 Digits; Design Item Id: AS1117-BQFT; Supplier 1: Digi-Key; Supplier Part Number 1: AS1117-BQFTCT-ND; Manufacturer Part Number: AS1117-BQFT; RoHS: RoHS Compliant; Category: Integrated Circuits (ICs); Stock 1: 662; Pricing 1: 1=4.23, 10=3.804, 25=3.452, 100=3.0997, 250=2.81792, 500=2.46566 (USD); Packaging: Cut Tape (CT); Operating Temperature: -40°C ~ 85°C; Mounting Type: Surface Mount; Package / Case: 24-UFQFN Exposed Pad; Supplier Device Package: 24-TQFN (4x4); ComponentLink1URL: http://www.ams.com/content/download/48343/529874/32295; ComponentLink1Description: http://www.ams.com/content/download/48343/529874/32295
U6 U7 = QDSP-6064: HP 4-Digit LED 7-Segment Bubble Display; Design Item Id: QDSP-6064; Supplier 1: Sparkfun; Supplier Part Number 1: COM-12710; Manufacturer: HP; Manufacturer Part Number: QDSP-6064; Category: Display; Stock 1: 100; Pricing 1: 2.95; Packaging: 12-pin DIP

## Sheet Battery_Power.SchDoc
size B; Organization: Mechanart, LLC; Address1: 397 Laurie Meadows Drive; Address2: Apt. 437; Address3: San Mateo, CA 94403
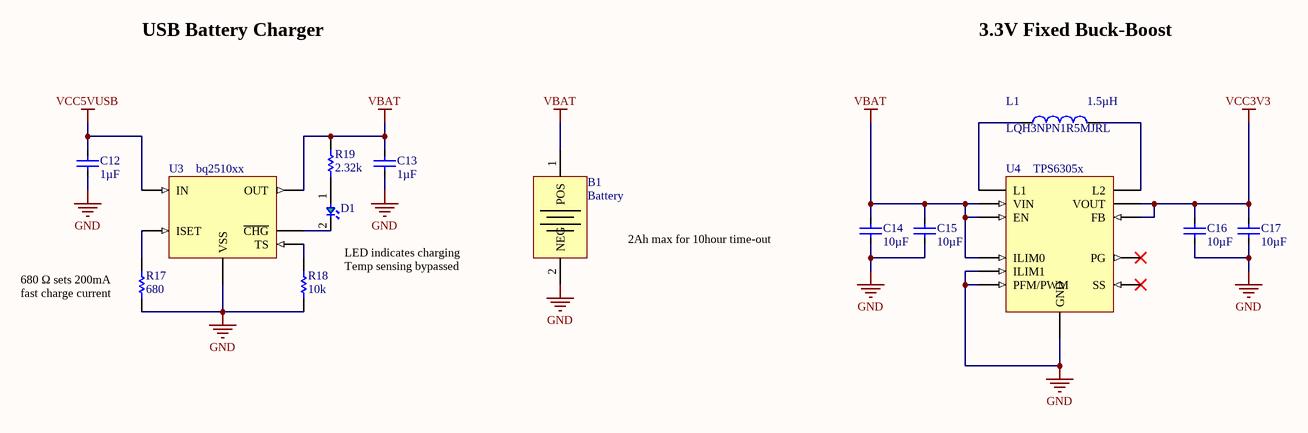
[diagram p4: Battery_Power.SchDoc]

### Parts
B1  Battery  [S2B-PH-SM4]
C12  1µF  [CAPC1005X50L25N]
C13  1µF  [CAPC1005X50L25N]
C14  10µF  [CAPC1220X95L30L]
C15  10µF  [CAPC1220X95L30L]
C16  10µF  [CAPC1220X95L30L]
C17  10µF  [CAPC1220X95L30L]
D1  Green LED  [SML-P11Mxxx]  (value not drawn)
L1  1.5µH  Manufacturer Part Number: LQH3NPN1R5MJRL  [INDC3030X30L90L]
R17  680  [RESC1005X40L25N]
R18  10k  [RESC1005X40L25N]
R19  2.32k  [RESC1005X40L25N]
U3  bq2510xx  [BGA6C40P3X2_157X88X50B23L]
U4  TPS6305x  [BGA12C40P4X3_168X128X62B25L]

### Nets
GND: B1.2(NEG) C12.2 C13.2 C14.2 C15.2 C16.2 C17.2 R17.1 R18.1 U3.C2(VSS) U4.B1(GND) U4.B3(ILIM1) U4.C2(PFM/PWM)
VBAT: B1.1(POS) C13.1 C14.1 C15.1 R19.2 U3.A1(OUT) U4.A2(VIN) U4.A3(EN) U4.B2(ILIM0)
VCC3V3: C16.1 C17.1 U4.D1(VOUT) U4.D2(FB)
VCC5VUSB: C12.1 U3.A2(IN)
NetD1_1: D1.1(A) R19.1
NetD1_2: D1.2(C) U3.C1(~{CHG})
NetL1_1: L1.1 U4.A1(L1)
NetL1_2: L1.2 U4.C1(L2)
NetR17_2: R17.2 U3.B2(ISET)
NetR18_2: R18.2 U3.B1(TS)

Not connected (* = marked no-connect by the designer): U4 C3(PG)* D3(SS)*

### Notes on the sheet
- USB Battery Charger
- 3.3V Fixed Buck-Boost
- (near R17) 680 Ω sets 200mA fast charge current
- LED indicates charging
  Temp sensing bypassed
- 2Ah max for 10hour time-out
- Title
- Size:
- Date:
- B
- Number:
- Time:
- Revision:
- Sheet
- of
- File:

### Library data of the parts
B1 = S2B-PH-SM4-TB(LF)(SN): CONN HEADER PH SIDE 2POS 2MM SMD; Manufacturer: JST Sales America Inc.; Connector Type: Header, Shrouded; Number of Positions: 2; Number of Positions Loaded: All; Pitch: 0.079" (2.00mm); Design Item Id: S2B-PH-SM4-TB(LF)(SN); Supplier 1: Digi-Key; Supplier Part Number 1: 455-1749-1-ND; Manufacturer Part Number: S2B-PH-SM4-TB(LF)(SN); RoHS: RoHS Compliant; Category: Connectors, Interconnects; Stock 1: 161962; Pricing 1: 1=0.56, 10=0.521, 25=0.4688, 50=0.4168, 100=0.3994, 250=0.36472, 500=0.34734 (USD); Packaging: Cut Tape (CT); Mounting Type: Surface Mount, Right Angle; ComponentLink1URL: http://www.jst-mfg.com/product/pdf/eng/ePH.pdf; ComponentLink1Description: http://www.jst-mfg.com/product/pdf/eng/ePH.pdf; Contact Type: Male Pin; Number of Rows: 1; Row Spacing: -; Contact Mating Length: 0.130" (3.30mm); Termination: Solder; Fastening Type: Detent Lock; Features: Solder Retention; Contact Finish: Tin; Contact Finish Thickness: -; Color: Natural
C12 C13 = GRM155R70J105KA12D: as C21 on sheet ATmega_MCU; Design Item Id: GRM155R70J105KA12D; Supplier 1: Digi-Key; Supplier Part Number 1: 490-10024-1-ND; Manufacturer Part Number: GRM155R70J105KA12D; RoHS: RoHS Compliant; Category: Capacitors; Stock 1: 26230; Pricing 1: 1=0.1, 10=0.076, 50=0.041, 100=0.0347, 250=0.02836, 500=0.02426, 1000=0.0189, 5000=0.01575 (USD); Packaging: Cut Tape (CT); Applications: General Purpose; Operating Temperature: -55°C ~ 125°C; Mounting Type: Surface Mount, MLCC; Package / Case: 0402 (1005 Metric); ComponentLink1URL: http://www.murata.com/~/media/webrenewal/support/library/catalog/products/capacitor/mlcc/c02e.ashx; ComponentLink1Description: http://www.murata.com/~/media/webrenewal/support/library/catalog/products/capacitor/mlcc/c02e.ashx; Capacitance: 1µF; Voltage - Rated: 6.3V; Temperature Coefficient: X7R; Ratings: -; Size / Dimension: 0.039" L x 0.020" W (1.00mm x 0.50mm); Height - Seated (Max): -; Thickness (Max): 0.022" (0.55mm); Lead Spacing: -; Features: Derating Recommended; Lead Style: -
C14-C17 = JWK212C6106MD-T: CAP CER 10UF 6.3V X6S 0508; Manufacturer: Taiyo Yuden; Tolerance: ±20%; Design Item Id: JWK212C6106MD-T; Supplier 1: Digi-Key; Supplier Part Number 1: 587-3114-1-ND; Manufacturer Part Number: JWK212C6106MD-T; RoHS: RoHS Compliant; Category: Capacitors; Stock 1: 18381; Pricing 1: 1=0.58, 10=0.457, 50=0.3306, 100=0.2755, 250=0.20664, 500=0.17632, 1000=0.13775 (USD); Packaging: Cut Tape (CT); Applications: Bypass, Decoupling; Operating Temperature: -55°C ~ 105°C; Mounting Type: Surface Mount, MLCC; Package / Case: 0508 (1220 Metric); ComponentLink1URL: http://media.digikey.com/pdf/Data%20Sheets/Taiyo%20Yuden%20PDFs%20URL%20links/JWK,%20AWK.pdf; ComponentLink1Description: http://media.digikey.com/pdf/Data%20Sheets/Taiyo%20Yuden%20PDFs%20URL%20links/JWK,%20AWK.pdf; Capacitance: 10µF; Voltage - Rated: 6.3V; Temperature Coefficient: X6S; Ratings: -; Size / Dimension: 0.049" L x 0.079" W (1.25mm x 2.00mm); Height - Seated (Max): -; Thickness (Max): 0.037" (0.95mm); Lead Spacing: -; Features: Low ESL (Reverse Geometry); Lead Style: -
D1 = SML-P11MTT86: LED GREEN CLEAR 0402 SMD; Manufacturer: Rohm Semiconductor; Lens Color: Colorless; Millicandela Rating: 2.1mcd; Lens Style/Size: Square with Flat Top, 0.60mm; Voltage - Forward (Vf) (Typ): 1.9V; Current - Test: 1mA; Wavelength - Dominant: 569nm; Design Item Id: SML-P11MTT86; Supplier 1: Digi-Key; Supplier Part Number 1: 511-1652-1-ND; RoHS: RoHS Compliant; Category: Optoelectronics; Stock 1: 349790; Pricing 1: 1=0.54, 10=0.4, 25=0.32, 100=0.212, 250=0.15, 500=0.128, 1000=0.1, 2500=0.088, 5000=0.076 (USD); Packaging: Cut Tape (CT); Mounting Type: Surface Mount; Package / Case: 0402 (1005 Metric); Supplier Device Package: *; ComponentLink1URL: http://rohmfs.rohm.com/en/products/databook/datasheet/opto/led/chip_mono/sml-p11_p-eco.pdf; ComponentLink1Description: http://rohmfs.rohm.com/en/products/databook/datasheet/opto/led/chip_mono/sml-p11_p-eco.pdf; Color: Green; Lens Transparency: Clear; Viewing Angle: -; Wavelength - Peak: -; Features: -; Size / Dimension: 1.00mm L x 0.60mm W; Height (Max): 0.25mm; Manufacturer Part Number: SML-P11MTT86
L1 = LQH3NPN1R5MJRL: FIXED IND 1.5UH 1.1A 49 MOHM SMD; Manufacturer: Murata Electronics North America; Type: Wirewound; Material - Core: Ferrite; Tolerance: ±20%; Current - Saturation: 1.95A; Shielding: Shielded; DC Resistance (DCR): 58.8 mOhm Max; Frequency - Self Resonant: 60MHz; Frequency - Test: 1MHz; Design Item Id: LQH3NPN1R5MJRL; Supplier 1: Digi-Key; Supplier Part Number 1: 490-9576-1-ND; RoHS: RoHS Compliant; Category: Inductors, Coils, Chokes; Stock 1: 1584; Pricing 1: 1=0.45, 10=0.409, 25=0.3632, 50=0.3178, 100=0.2951, 250=0.2724, 500=0.25878, 750=0.23608, 1000=0.20884 (USD); Packaging: Cut Tape (CT); Operating Temperature: -40°C ~ 105°C; Mounting Type: Surface Mount; Package / Case: 1212 (3030 Metric); Supplier Device Package: 1212 (3030 Metric); ComponentLink1URL: http://psearch.murata.com/inductor/product/LQH3NPNR68NJR#.pdf; ComponentLink1Description: http://psearch.murata.com/inductor/product/LQH3NPNR68NJR#.pdf; Inductance: 1.5µH; Current Rating: 1.1A; Q @ Freq: -; Size / Dimension: 0.118" L x 0.118" W (3.00mm x 3.00mm); Height - Seated (Max): 0.047" (1.20mm)
R17 = ERJ-2RKF6800X: RES SMD 680 OHM 1% 1/10W 0402; Manufacturer: Panasonic Electronic Components; Power (Watts): 0.1W, 1/10W; Temperature Coefficient: ±100ppm/°C; Design Item Id: ERJ-2RKF6800X; Resistance: 680; Footprint: RESC_1005[0402]_N; Supplier 1: Digi-Key; Supplier Part Number 1: P680LCT-ND; Manufacturer Part Number: ERJ-2RKF6800X; RoHS: RoHS Compliant; Category: Resistors; Stock 1: 260284; Pricing 1: 1=0.1, 50=0.015, 100=0.011, 250=0.0084, 500=0.00674, 1000=0.00496, 5000=0.00355 (USD); Packaging: Cut Tape (CT); Operating Temperature: -55°C ~ 155°C; Package / Case: 0402 (1005 Metric); Supplier Device Package: 0402; ComponentLink1URL: http://industrial.panasonic.com/www-cgi/jvcr13pz.cgi?E+PZ+3+AOA0002+ERJ2RKF6800X+7+WW; ComponentLink1Description: http://industrial.panasonic.com/www-cgi/jvcr13pz.cgi?E+PZ+3+AOA0002+ERJ2RKF6800X+7+WW; Tolerance: ±1%; Composition: Thick Film; Features: Automotive AEC-Q200; Size / Dimension: 0.039" L x 0.020" W (1.00mm x 0.50mm); Height: 0.016" (0.40mm); Number of Terminations: 2
R18 = CRCW040210K0JNED: as R13 on sheet Analog_Front_End; Design Item Id: CRCW040210K0JNED; Resistance: 10k; Footprint: RESC_1005[0402]_N; Supplier 1: Digi-Key; Supplier Part Number 1: 541-10KJCT-ND; Manufacturer Part Number: CRCW040210K0JNED; RoHS: RoHS Compliant; Category: Resistors; Stock 1: 446077; Pricing 1: 10=0.074, 50=0.04, 200=0.02295, 1000=0.01566 (USD); Packaging: Cut Tape (CT); Operating Temperature: -55°C ~ 155°C; Package / Case: 0402 (1005 Metric); Supplier Device Package: 0402 (1005 Metric); ComponentLink1URL: http://www.vishay.com/docs/20035/dcrcwe3.pdf; ComponentLink1Description: http://www.vishay.com/docs/20035/dcrcwe3.pdf; Tolerance: ±5%; Composition: Thick Film; Features: Automotive AEC-Q200; Size / Dimension: 0.039" L x 0.020" W (1.00mm x 0.50mm); Height: 0.016" (0.40mm); Number of Terminations: 2
R19 = ERJ-2RKF2321X: RES SMD 2.32K OHM 1% 1/10W 0402; Manufacturer: Panasonic Electronic Components; Power (Watts): 0.1W, 1/10W; Temperature Coefficient: ±100ppm/°C; Design Item Id: ERJ-2RKF2321X; Resistance: 2.32k; Footprint: RESC_1005[0402]_N; Supplier 1: Digi-Key; Supplier Part Number 1: P2.32KLCT-ND; Manufacturer Part Number: ERJ-2RKF2321X; RoHS: RoHS Compliant; Category: Resistors; Stock 1: 166119; Pricing 1: 1=0.1, 50=0.0124, 100=0.0091, 250=0.00692, 500=0.00554, 1000=0.00408, 5000=0.00293 (USD); Packaging: Cut Tape (CT); Operating Temperature: -55°C ~ 155°C; Package / Case: 0402 (1005 Metric); Supplier Device Package: 0402; ComponentLink1URL: http://industrial.panasonic.com/www-cgi/jvcr13pz.cgi?E+PZ+3+AOA0002+ERJ2RKF2321X+7+WW; ComponentLink1Description: http://industrial.panasonic.com/www-cgi/jvcr13pz.cgi?E+PZ+3+AOA0002+ERJ2RKF2321X+7+WW; Tolerance: ±1%; Composition: Thick Film; Features: Automotive AEC-Q200; Size / Dimension: 0.039" L x 0.020" W (1.00mm x 0.50mm); Height: 0.016" (0.40mm); Number of Terminations: 2
U3 = BQ25101YFPR: IC LI-ION CHARGE MGMT 6DSBGA; Manufacturer: Texas Instruments; Voltage - Supply: 3.5 V ~ 28 V; Function: Charge Management; Battery Chemistry: Li-Ion, Li-Pol; Design Item Id: BQ25101YFPR; Supplier 1: Digi-Key; Supplier Part Number 1: 296-39933-1-ND; Manufacturer Part Number: BQ25101YFPR; RoHS: RoHS Compliant; Category: Integrated Circuits (ICs); Stock 1: 614; Pricing 1: 1=2.05, 10=1.843, 100=1.4783, 500=1.215, 1000=0.84375 (USD); Packaging: Cut Tape (CT); Operating Temperature: 0°C ~ 125°C; Mounting Type: Surface Mount; Package / Case: 6-XFBGA, DSBGA; Supplier Device Package: 6-DSBGA; ComponentLink1URL: http://www.ti.com/lit/ds/symlink/bq25100h.pdf; ComponentLink1Description: http://www.ti.com/lit/ds/symlink/bq25100h.pdf
U4 = TPS63051YFFR: IC REG BCK BST 3.3V 0.5A 12DSBGA; Manufacturer: Texas Instruments; Output Type: Fixed; Number of Outputs: 1; Frequency - Switching: 2.5MHz; Current - Output: 500mA; Synchronous Rectifier: Yes; Function: Step-Up/Step-Down; Output Configuration: Positive; Topology: Buck-Boost; Voltage - Input (Min): 2.5V; Voltage - Input (Max): 5.5V; Design Item Id: TPS63051YFFR; Supplier 1: Digi-Key; Supplier Part Number 1: 296-40860-1-ND; Manufacturer Part Number: TPS63051YFFR; RoHS: RoHS Compliant; Category: Integrated Circuits (ICs); Stock 1: 2089; Pricing 1: 1=2.27, 10=2.039, 100=1.6359, 500=1.3446, 1000=0.93375 (USD); Packaging: Cut Tape (CT); Operating Temperature: -40°C ~ 85°C (TA); Mounting Type: Surface Mount; Package / Case: 12-UFBGA, DSBGA; Supplier Device Package: 12-DSBGA (1.6x1.2); ComponentLink1URL: http://www.ti.com/lit/ds/symlink/tps63050.pdf; ComponentLink1Description: http://www.ti.com/lit/ds/symlink/tps63050.pdf; Voltage - Output (Min/Fixed): 3.3V; Voltage - Output (Max): -

## Nets that join several sheets
GND: Analog_Front_End (20 pins), ATmega_MCU (29 pins), Display (5 pins), Battery_Power (13 pins)
VCC3V3: Analog_Front_End (8 pins), ATmega_MCU (15 pins), Display (5 pins), Battery_Power (C16.1 C17.1 U4.D1 U4.D2)
VCC5VUSB: ATmega_MCU (R1.2 U8.4), Battery_Power (C12.1 U3.A2)
MCU_SCL: Analog_Front_End (U1.10), ATmega_MCU (R15.1 U2.28 Y2.6), Display (U5.11)
MCU_SDA: Analog_Front_End (U1.9), ATmega_MCU (R14.1 U2.27 Y2.7), Display (U5.22)
NetR23_1: Analog_Front_End (U1.2), ATmega_MCU (R23.1 U2.13)
NetU2_32: ATmega_MCU (U2.32), Display (U5.21)